# Altium schematic sheet [01] - COVER PAGE.SchDoc
size A3; DocumentNumber: 1; SheetNumber: 1; SheetTotal: 5
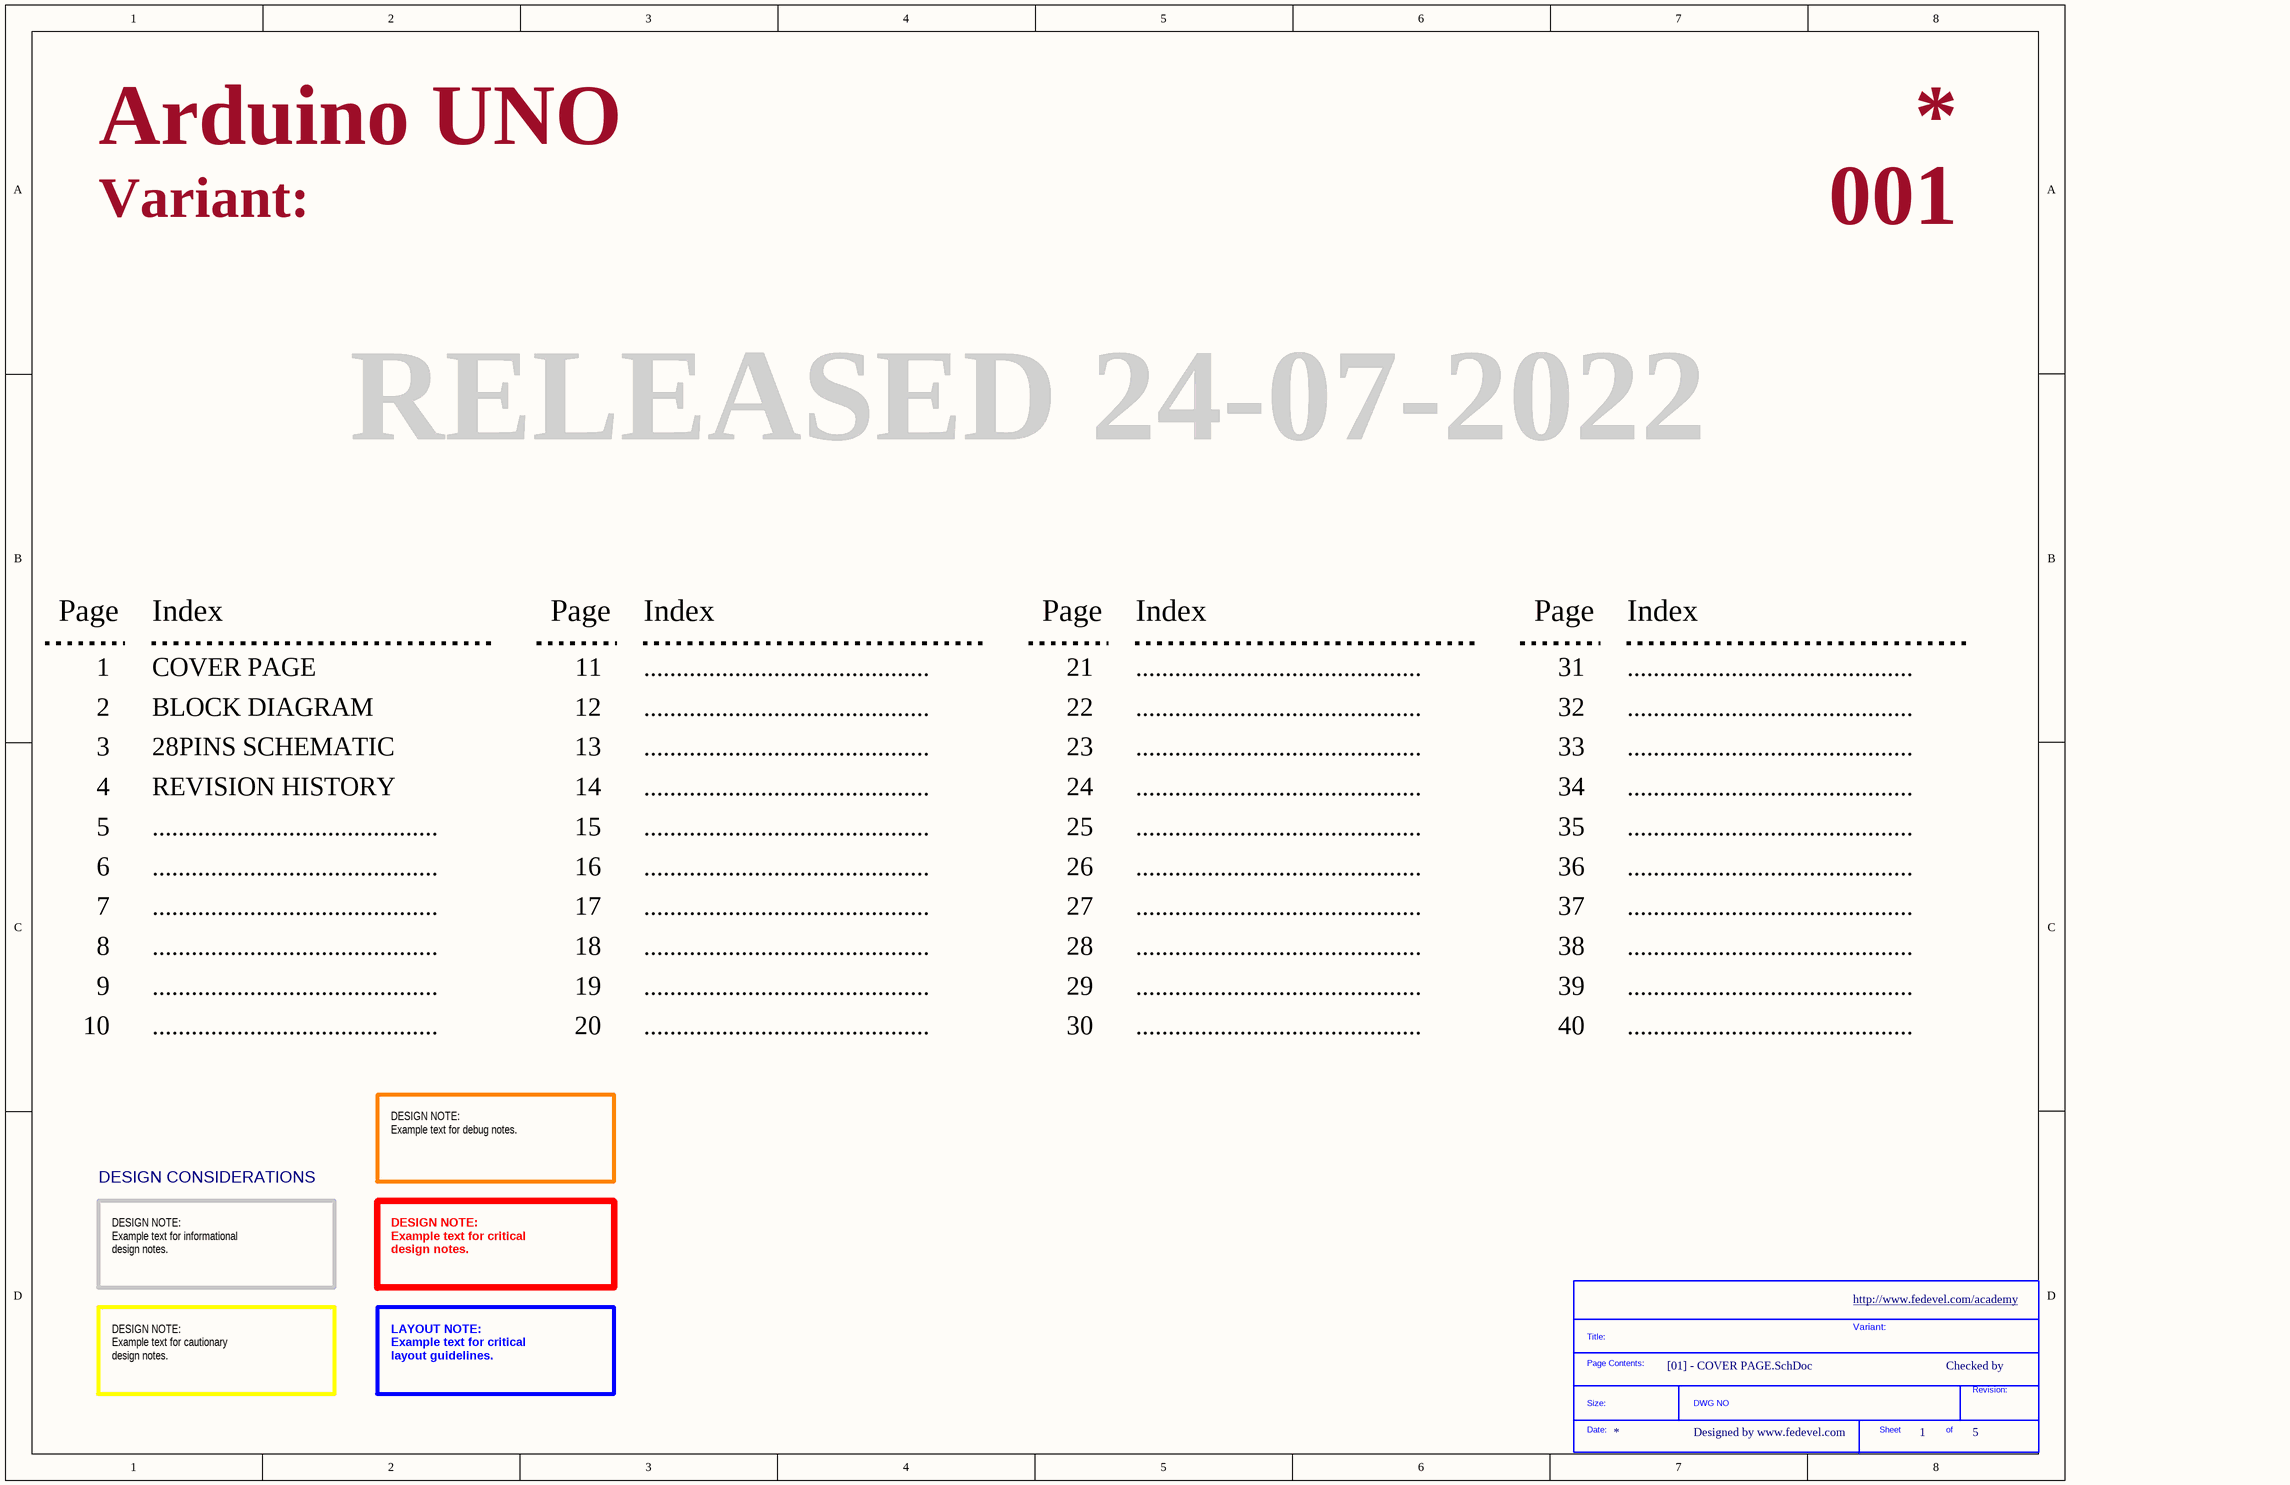
[diagram p0: [01] - COVER PAGE.SchDoc]

## Parts
*  SDTitleBlock  (value not drawn)  (graphical)

## Notes on the sheet
- Arduino UNO
- Variant:
- 001
- RELEASED 24-07-2022
- Page
- Index
- 1
- COVER PAGE
- 11
- ............................................
- 21
- 31
- 2
- 3
- BLOCK DIAGRAM
- 28PINS SCHEMATIC
- 12
- 13
- 22
- 23
- 32
- 33
- 4
- 5
- REVISION HISTORY
- 14
- 15
- 24
- 25
- 34
- 35
- 6
- 16
- 26
- 36
- 7
- 8
- 17
- 18
- 27
- 28
- 37
- 38
- 9
- 10
- 19
- 20
- 29
- 30
- 39
- 40
- DESIGN NOTE:
  Example text for debug notes.
- DESIGN CONSIDERATIONS
- DESIGN NOTE:
  Example text for informational
  design notes.
- DESIGN NOTE:
  Example text for critical
  design notes.
- http://www.fedevel.com/academy
- Checked by
- DESIGN NOTE:
  Example text for cautionary
  design notes.
- LAYOUT NOTE:
  Example text for critical
  layout guidelines.
- Designed by www.fedevel.com
- (in symbol SDTitleBlock) Title:; Page Contents:; Revision:; Size:; DWG NO; Date:; Sheet; of